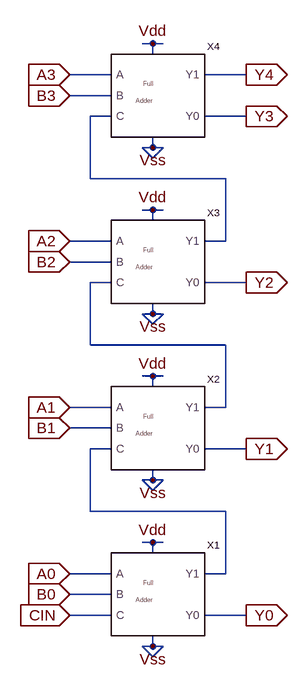
[diagram p0: schematic 4bitadder.asc]
4bitadder.asc, the LTspice schematic file:
Version 4
SHEET 1 1900 1012
WIRE 1104 32 1088 32
WIRE 1120 32 1104 32
WIRE 1104 48 1104 32
WIRE 1040 80 976 80
WIRE 1248 80 1184 80
WIRE 1040 112 976 112
WIRE 1040 144 1008 144
WIRE 1248 144 1184 144
WIRE 1104 192 1104 176
WIRE 1104 192 1088 192
WIRE 1120 192 1104 192
WIRE 1104 208 1088 192
WIRE 1104 208 1120 192
WIRE 1008 240 1008 144
WIRE 1216 240 1008 240
WIRE 1104 288 1088 288
WIRE 1120 288 1104 288
WIRE 1104 304 1104 288
WIRE 1040 336 976 336
WIRE 1216 336 1216 240
WIRE 1216 336 1184 336
WIRE 1040 368 976 368
WIRE 1040 400 1008 400
WIRE 1248 400 1184 400
WIRE 1104 448 1104 432
WIRE 1104 448 1088 448
WIRE 1120 448 1104 448
WIRE 1104 464 1088 448
WIRE 1104 464 1120 448
WIRE 1008 496 1008 400
WIRE 1216 496 1008 496
WIRE 1104 544 1088 544
WIRE 1120 544 1104 544
WIRE 1104 560 1104 544
WIRE 1040 592 976 592
WIRE 1216 592 1216 496
WIRE 1216 592 1184 592
WIRE 1040 624 976 624
WIRE 1040 656 1008 656
WIRE 1248 656 1184 656
WIRE 1104 704 1104 688
WIRE 1104 704 1088 704
WIRE 1120 704 1104 704
WIRE 1104 720 1088 704
WIRE 1104 720 1120 704
WIRE 1008 752 1008 656
WIRE 1216 752 1008 752
WIRE 1104 800 1088 800
WIRE 1120 800 1104 800
WIRE 1104 816 1104 800
WIRE 1040 848 976 848
WIRE 1216 848 1216 752
WIRE 1216 848 1184 848
WIRE 1040 880 976 880
WIRE 1040 912 976 912
WIRE 1248 912 1184 912
WIRE 1104 960 1104 944
WIRE 1104 960 1088 960
WIRE 1120 960 1104 960
WIRE 1104 976 1088 960
WIRE 1104 976 1120 960
FLAG 976 848 A0
IOPIN 976 848 In
FLAG 976 880 B0
IOPIN 976 880 In
FLAG 1104 800 Vdd
FLAG 1104 960 Vss
FLAG 976 592 A1
IOPIN 976 592 In
FLAG 976 624 B1
IOPIN 976 624 In
FLAG 1104 544 Vdd
FLAG 1104 704 Vss
FLAG 976 336 A2
IOPIN 976 336 In
FLAG 976 368 B2
IOPIN 976 368 In
FLAG 1104 288 Vdd
FLAG 1104 448 Vss
FLAG 976 80 A3
IOPIN 976 80 In
FLAG 976 112 B3
IOPIN 976 112 In
FLAG 1104 32 Vdd
FLAG 1104 192 Vss
FLAG 976 912 CIN
IOPIN 976 912 In
FLAG 1248 912 Y0
IOPIN 1248 912 Out
FLAG 1248 656 Y1
IOPIN 1248 656 Out
FLAG 1248 400 Y2
IOPIN 1248 400 Out
FLAG 1248 144 Y3
IOPIN 1248 144 Out
FLAG 1248 80 Y4
IOPIN 1248 80 Out
SYMBOL fulladder 1040 944 R0
SYMATTR InstName X1
SYMBOL fulladder 1040 688 R0
SYMATTR InstName X2
SYMBOL fulladder 1040 432 R0
SYMATTR InstName X3
SYMBOL fulladder 1040 176 R0
SYMATTR InstName X4

The netlist it stands for:
* 4bitadder.asc
XX1 A0 B0 Y0 N003 Vdd Vss CIN fulladder  ; pins A B Y0 Y1 Vdd Vss C
XX2 A1 B1 Y1 N002 Vdd Vss N003 fulladder  ; pins A B Y0 Y1 Vdd Vss C
XX3 A2 B2 Y2 N001 Vdd Vss N002 fulladder  ; pins A B Y0 Y1 Vdd Vss C
XX4 A3 B3 Y3 Y4 Vdd Vss N001 fulladder  ; pins A B Y0 Y1 Vdd Vss C
.backanno
.end